# EAGLE schematic Charger (EAGLE 6.1)
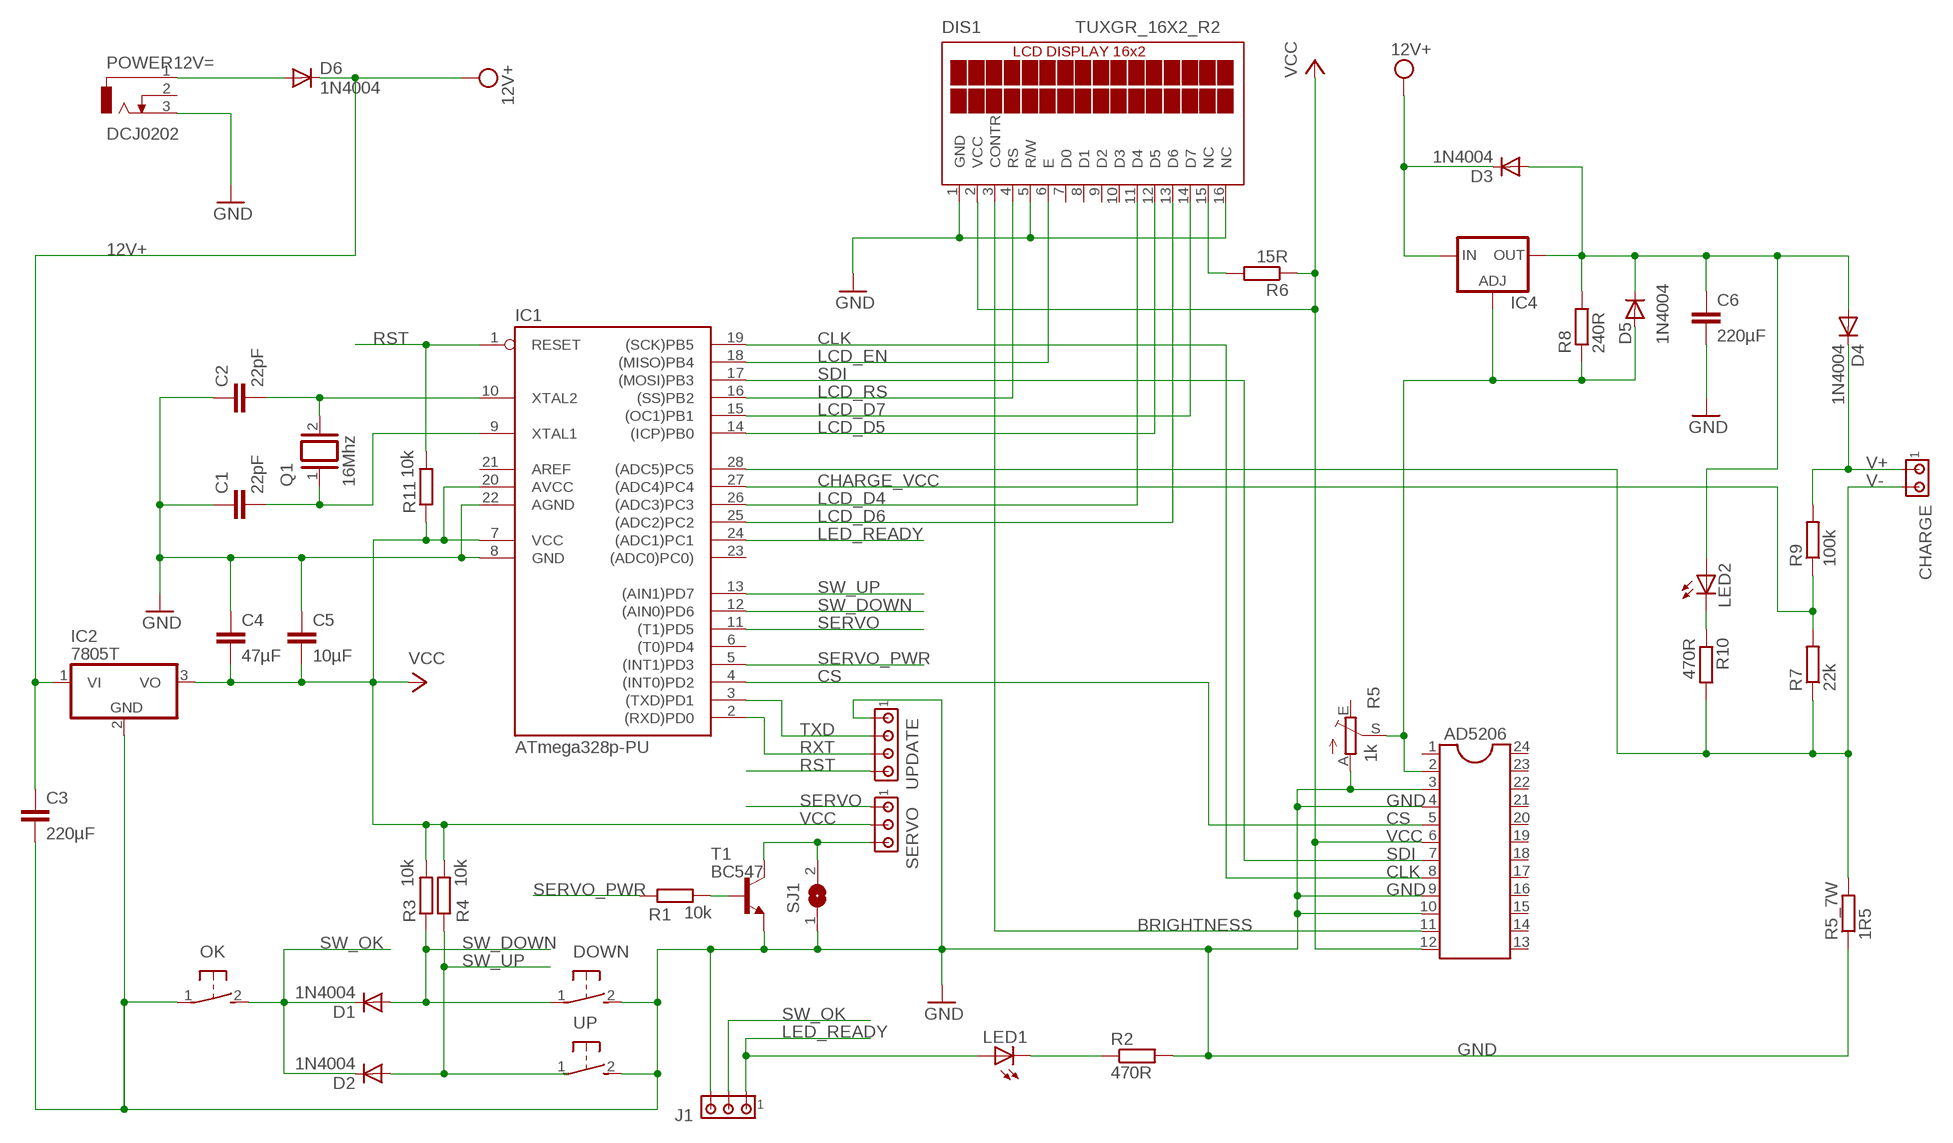
[diagram p0: schematic, sheet 1]

## Parts
AD5206  DIL24-3  [DIL24-3]
C1  22pF  C2,5-3  [C2.5-3]
C2  22pF  C2,5-3  [C2.5-3]
C3  220µF  C2.5/6  [C2.5-6]
C4  47µF  C2.5/6  [C2.5-6]
C5  10µF  C2.5/6  [C2.5-6]
C6  220µF  C2.5/6  [C2.5-6]
CHARGE  MTA02-156  [1X2MTA]
D1  1N4004  [DO41-10]
D2  1N4004  [DO41-10]
D3  1N4004  [DO41-10]
D4  1N4004  [DO41-10]
D5  1N4004  [DO41-10]
D6  1N4004  [DO41-10]
DIS1  TUXGR_16X2_R2  [TUXGR_16X2_R2]
DOWN  31-XX  [B3F-31XX]
IC1  ATmega328p-PU  AT90S2333P  [DIL28-3]
IC2  7805T  [TO220H]
IC4  LM317TL  [317TL]
J1  MTA03-156  [1X3MTA]
LED1  LED3MM  [LED3MM]
LED2  LED3MM  [LED3MM]
OK  31-XX  [B3F-31XX]
POWER12V=  DCJ0202  [DCJ0202]
Q1  16Mhz  XTAL/S  [QS]
R1  10k  R-EU_0207/10  [0207/10]
R2  470R  R-EU_0207/10  [0207/10]
R3  10k  R-EU_0207/10  [0207/10]
R4  10k  R-EU_0207/10  [0207/10]
R5  1k  TRIM_EU-B25V  [B25V]
R5_7W  1R5  R-EU_0207/10  [0207/10]
R6  15R  R-EU_0207/10  [0207/10]
R7  22k  R-EU_0207/10  [0207/10]
R8  240R  R-EU_0207/10  [0207/10]
R9  100k  R-EU_0207/10  [0207/10]
R10  470R  R-EU_0207/10  [0207/10]
R11  10k  R-EU_0207/10  [0207/10]
SERVO  MTA03-100  [10X03MTA]
SJ1  SJW  [SJW]
T1  BC547  [TO92]
UP  31-XX  [B3F-31XX]
UPDATE  350826-1  [350826-1]

## Nets
12V+: C3.1 D6.C IC2.1(VI)
BRIGHTNESS: AD5206.11 DIS1.3(CONTR)
CHARGE_VCC: IC1.27((ADC4)PC4) R7.2 R9.1
CLK: AD5206.8 IC1.19((SCK)PB5)
CS: AD5206.5 IC1.4((INT0)PD2)
GND: AD5206.3 AD5206.4 AD5206.9 AD5206.10 C1.1 C2.1 C3.2 C4.1 C5.1 C6.2 DIS1.1(GND) DIS1.5(R/W) DIS1.16(NC) DOWN.2(S) IC1.8(GND) IC1.22(AGND) IC2.2(GND) J1.3 OK.1(P) POWER12V=.3 R2.2 R5.A R5_7W.1 SJ1.1 T1.1(E) UP.2(S) UPDATE.1
LCD_D4: DIS1.11(D4) IC1.26((ADC3)PC3)
LCD_D5: DIS1.12(D5) IC1.14((ICP)PB0)
LCD_D6: DIS1.13(D6) IC1.25((ADC2)PC2)
LCD_D7: DIS1.14(D7) IC1.15((OC1)PB1)
LCD_EN: DIS1.6(E) IC1.18((MISO)PB4)
LCD_RS: DIS1.4(RS) IC1.16((SS)PB2)
LED_READY: IC1.24((ADC1)PC1) J1.1 LED1.A
N$1: C6.1 D3.A D4.A D5.C IC4.2(OUT) LED2.A R8.2
N$2: LED2.K(C) R10.1
N$3: D6.A POWER12V=.1
N$8: AD5206.2 D5.A IC4.1(ADJ) R5.S R8.1
N$12: LED1.K(C) R2.1
N$13: DIS1.15(NC) R6.2
N$14: R1.2 T1.2(B)
N$15: SERVO.3 SJ1.2 T1.3(C)
N$25: C1.2 IC1.9(XTAL1) Q1.1
N$26: C2.2 IC1.10(XTAL2) Q1.2
RST: IC1.1(RESET) R11.2 UPDATE.4
RXT: IC1.2((RXD)PD0) UPDATE.3
SDI: AD5206.7 IC1.17((MOSI)PB3)
SERVO: IC1.11((T1)PD5) SERVO.1
SERVO_PWR: IC1.5((INT1)PD3) R1.1
SW_DOWN: D1.A DOWN.1(P) IC1.12((AIN0)PD6) R3.1
SW_OK: D1.C D2.C J1.2 OK.2(S)
SW_UP: D2.A IC1.13((AIN1)PD7) R4.1
TXD: IC1.3((TXD)PD1) UPDATE.2
V+: CHARGE.1 D4.C R9.2
V-: CHARGE.2 IC1.28((ADC5)PC5) R5_7W.2 R7.1 R10.2
VCC: AD5206.6 AD5206.12 C4.2 C5.2 D3.C DIS1.2(VCC) IC1.7(VCC) IC1.20(AVCC) IC2.3(VO) IC4.3(IN) R3.2 R4.2 R6.1 R11.1 SERVO.2 ; supply symbol labelled 12V+
Unconnected: AD5206.1 AD5206.13 AD5206.14 AD5206.15 AD5206.16 AD5206.17 AD5206.18 AD5206.19 AD5206.20 AD5206.21 AD5206.22 AD5206.23 AD5206.24 DIS1.7(D0) DIS1.8(D1) DIS1.9(D2) DIS1.10(D3) IC1.6((T0)PD4) IC1.21(AREF) IC1.23((ADC0)PC0)) POWER12V=.2 R5.E UP.1(P)

## Library data of the parts
AD5206 = ic-package:DIL24: Dual In Line
C1-C6 = capacitor-wima:C: CAPACITOR naming: grid - package width
CHARGE = con-amp:MTA02-156: AMP connector
D1-D6 = diode:1N4004: DIODE general purpose rectifier, 1 A
DIS1 = display-lcd:TUXGR_16X2_R2: Tuxgraphics LCD display 16x2 characters reflective, without background light Source: tuxgr_12x2_r2.pdf; OC_FARNELL: unknown; OC_NEWARK: unknown
DOWN OK UP = switch-omron:31-XX: OMRON SWITCH; MPN: B3F-3100; OC_FARNELL: 959704; OC_NEWARK: 36M3582
IC1 = atmel:AT90S2333P: MICROCONTROLLER 2 Kbytes FLASH 128 bytes SRAM 128 bytes EEPROM UART 6-channel 10-bit ADC; OC_FARNELL: unknown; OC_NEWARK: unknown
IC2 = linear:78*: Positive VOLTAGE REGULATOR Source: http://cache.national.com/ds/LM/LM78L05.pdf http://www.fairchildsemi.com/ds/LM/LM7805.pdf
IC4 = v-reg:LM317TL: VOLTAGE REGULATOR
J1 = con-amp:MTA03-156: AMP connector
LED1 LED2 = led:LED: LED OSRAM: - CHIPLED LG R971, LG N971, LY N971, LG Q971, LY Q971, LO R971, LY R971 LH N974, LH R974 LS Q976, LO Q976, LY Q976 LO Q996 - Hyper CHIPLED LW Q18S LB Q993, LB Q99A, LB R99A - SideLED LS A670, LO A670, LY A670, LG A670, LP A670 LB A673, LV A673, LT A673, LW A673 LH A674 LY A675 LS A676, LA A676, LO A676, LY A676, LW A676 LS A679, LY A679, LG A679 - Hyper Micro SIDELED® LS Y876, LA Y876, LO Y876, LY Y876 LT Y87S - SmartLED LW L88C, LW L88S LB L89C, LB L89S, LG L890 LS L89K, LO L89K, LY L89K LS L896, LA L896, LO L896, LY L896 - TOPLED LS T670, LO T670, LY T670, LG T670, LP T670 LSG T670, LSP T670, LSY T670, LOP T670, LYG T670 LG T671, LOG T671, LSG T671 LB T673, LV T673, LT T673, LW T673 LH T674 LS T676, LA T676, LO T676, LY T676, LB T676, LH T676, LSB T676, LW T676 LB T67C, LV T67C, LT T67C, LS T67K, LO T67K, LY T67K, LW E67C LS E67B, LA E67B, LO E67B, LY E67B, LB E67C, LV E67C, LT E67C LW T67C LS T679, LY T679, LG T679 LS T770, LO T770, LY T770, LG T770, LP T770 LB T773, LV T773, LT T773, LW T773 LH T774 LS E675, LA E675, LY E675, LS T675 LS T776, LA T776, LO T776, LY T776, LB T776 LHGB T686 LT T68C, LB T68C - Hyper Mini TOPLED® LB M676 - Mini TOPLED Santana® LG M470 LS M47K, LO M47K, LY M47K Source: http://www.osram.convergy.de LUXEON: - LUMILED® LXK2-PW12-R00, LXK2-PW12-S00, LXK2-PW14-U00, LXK2-PW14-V00 LXK2-PM12-R00, LXK2-PM12-S00, LXK2-PM14-U00 LXK2-PE12-Q00, LXK2-PE12-R00, LXK2-PE12-S00, LXK2-PE14-T00, LXK2-PE14-U00 LXK2-PB12-K00, LXK2-PB12-L00, LXK2-PB12-M00, LXK2-PB14-N00, LXK2-PB14-P00, LXK2-PB14-Q00 LXK2-PR12-L00, LXK2-PR12-M00, LXK2-PR14-Q00, LXK2-PR14-R00 LXK2-PD12-Q00, LXK2-PD12-R00, LXK2-PD12-S00 LXK2-PH12-R00, LXK2-PH12-S00 LXK2-PL12-P00, LXK2-PL12-Q00, LXK2-PL12-R00 Source: www.luxeon.com KINGBRIGHT: KA-3528ASYC Source: www.kingbright.com
POWER12V= = con-jack:DCJ0202: DC POWER JACK Source: DCJ0202.pdf; OC_FARNELL: unknown; OC_NEWARK: unknown
Q1 = special:XTAL/S: CRYSTAL
R1-R4 R5_7W R6-R11 = rcl:R-EU_: RESISTOR, European symbol
R5 = pot:TRIM_EU-: POTENTIOMETER
SERVO = con-amp:MTA03-100: AMP connector
SJ1 = jumper:SJ: SMD solder JUMPER
T1 = transistor:BC547: NPN TRANSISTOR
UPDATE = con-amp:350826-1: Universal MATE-N-LOK .250" Centerline, 600 V, 19 - 36 A max Source: http://catalog.tycoelectronics.com/ .. ENG_CD_350826_P.pdf